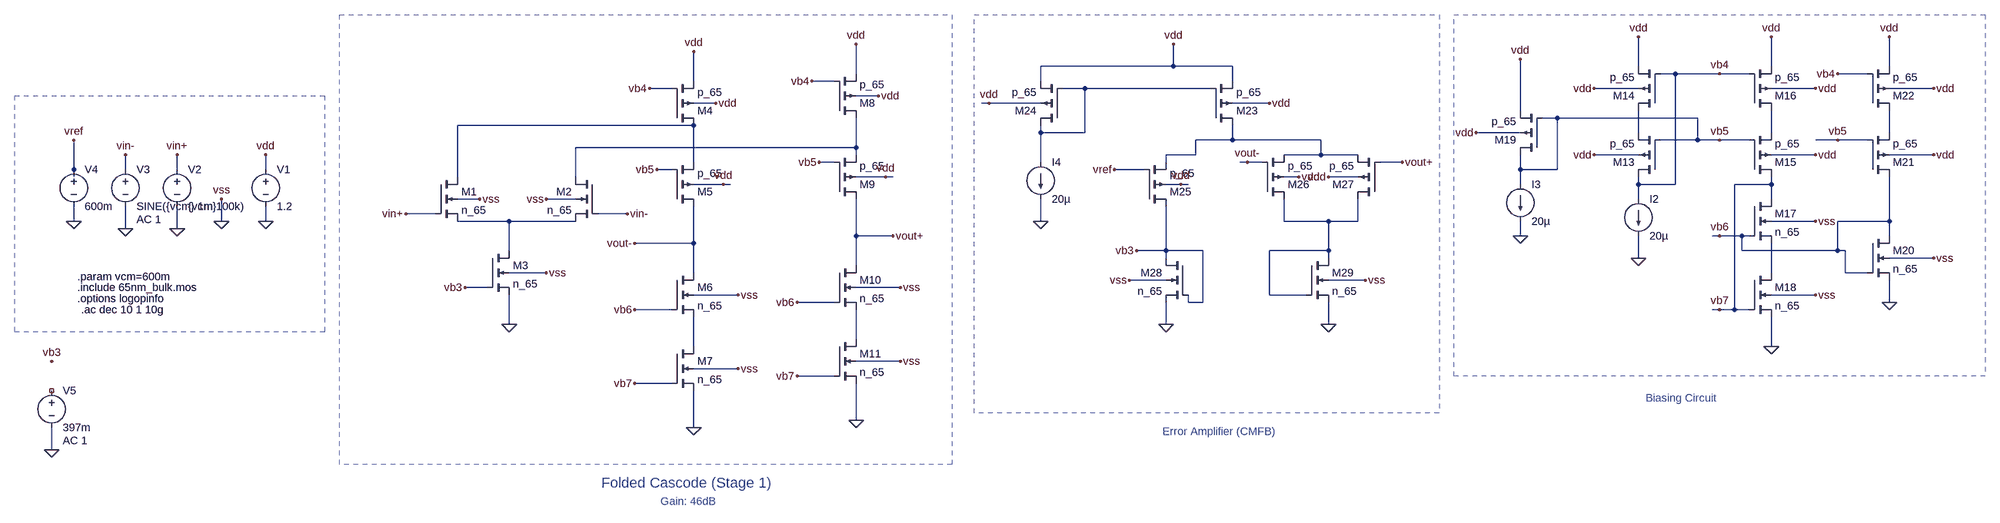
[diagram p0: schematic FC_DiffAmp_CMFB.asc]
FC_DiffAmp_CMFB.asc, the LTspice schematic file:
Version 4.1
SHEET 1 5060 800
WIRE 1712 -160 1712 -208
WIRE 1712 -160 1424 -160
WIRE 1840 -160 1712 -160
WIRE 2720 -160 2720 -224
WIRE 3008 -160 3008 -224
WIRE 3264 -160 3264 -224
WIRE 1024 -144 1024 -208
WIRE 2800 -144 2768 -144
WIRE 2896 -144 2800 -144
WIRE 2960 -144 2896 -144
WIRE 3216 -144 3152 -144
WIRE 672 -128 672 -192
WIRE 976 -128 928 -128
WIRE 1424 -128 1424 -160
WIRE 1840 -128 1840 -160
WIRE 624 -112 576 -112
WIRE 1520 -112 1472 -112
WIRE 1792 -112 1520 -112
WIRE 2720 -112 2624 -112
WIRE 3104 -112 3008 -112
WIRE 3360 -112 3264 -112
WIRE 1072 -96 1024 -96
WIRE 720 -80 672 -80
WIRE 1312 -80 1296 -80
WIRE 1424 -80 1312 -80
WIRE 1920 -80 1840 -80
WIRE 2464 -64 2464 -176
WIRE 2544 -48 2512 -48
WIRE 2848 -48 2544 -48
WIRE 672 -32 160 -32
WIRE 1424 -16 1424 -32
WIRE 1520 -16 1520 -112
WIRE 1520 -16 1424 -16
WIRE 2464 -16 2368 -16
WIRE 2720 -16 2720 -64
WIRE 3008 -16 3008 -64
WIRE 3264 -16 3264 -64
WIRE 1840 0 1840 -32
WIRE 1840 0 1760 0
WIRE 2032 0 1840 0
WIRE 2848 0 2848 -48
WIRE 2848 0 2768 0
WIRE 2896 0 2848 0
WIRE 2960 0 2896 0
WIRE 3152 0 3104 0
WIRE 3216 0 3152 0
WIRE 1024 16 1024 -48
WIRE 1024 16 416 16
WIRE 1024 32 1024 16
WIRE 1760 32 1760 0
WIRE 1760 32 1696 32
WIRE 2032 32 2032 0
WIRE 2032 32 1952 32
WIRE 2112 32 2032 32
WIRE 2720 32 2624 32
WIRE 3104 32 3008 32
WIRE 3360 32 3264 32
WIRE 672 48 672 -32
WIRE 976 48 944 48
WIRE 1424 48 1424 -16
WIRE 1696 48 1696 32
WIRE 1872 48 1856 48
WIRE 1904 48 1872 48
WIRE 2208 48 2160 48
WIRE -672 64 -672 0
WIRE -560 64 -560 32
WIRE -448 64 -448 32
WIRE -256 64 -256 32
WIRE 624 64 592 64
WIRE 1648 64 1584 64
WIRE 2464 64 2464 32
WIRE 2544 64 2544 -48
WIRE 2544 64 2464 64
WIRE -672 80 -672 64
WIRE 160 80 160 -32
WIRE 416 80 416 16
WIRE 1088 80 1024 80
WIRE 1104 80 1088 80
WIRE 1984 80 1952 80
WIRE 2112 80 2048 80
WIRE 736 96 672 96
WIRE 752 96 736 96
WIRE 1728 96 1696 96
WIRE 1744 96 1728 96
WIRE 2464 96 2464 64
WIRE 2720 96 2720 80
WIRE 2800 96 2800 -144
WIRE 2800 96 2720 96
WIRE 3008 96 3008 80
WIRE 3008 96 2928 96
WIRE 208 128 160 128
WIRE 416 128 352 128
WIRE 2720 128 2720 96
WIRE 3008 128 3008 96
WIRE 112 160 48 160
WIRE 528 160 464 160
WIRE -672 176 -672 144
WIRE -352 176 -352 128
WIRE -256 176 -256 144
WIRE 272 176 160 176
WIRE 416 176 272 176
WIRE 1424 176 1424 128
WIRE 1952 176 1952 128
WIRE 2048 176 1952 176
WIRE 2112 176 2112 128
WIRE 2112 176 2048 176
WIRE 3104 176 3008 176
WIRE 3264 176 3264 80
WIRE 3264 176 3152 176
WIRE -560 192 -560 144
WIRE -448 192 -448 144
WIRE 1024 208 1024 128
WIRE 1104 208 1024 208
WIRE 2464 208 2464 176
WIRE 2896 208 2880 208
WIRE 2944 208 2896 208
WIRE 2960 208 2944 208
WIRE 3264 208 3264 176
WIRE 672 224 672 144
WIRE 672 224 544 224
WIRE 272 240 272 176
WIRE 1696 240 1696 144
WIRE 1696 240 1632 240
WIRE 1776 240 1696 240
WIRE 2048 240 2048 176
WIRE 2048 240 1920 240
WIRE 2944 240 2944 208
WIRE 3152 240 3152 176
WIRE 3152 240 2944 240
WIRE 3168 240 3152 240
WIRE 1696 256 1696 240
WIRE 2048 256 2048 240
WIRE 2720 256 2720 208
WIRE 3360 256 3264 256
WIRE 1024 272 1024 208
WIRE 352 288 272 288
WIRE 672 288 672 224
WIRE 3008 288 3008 224
WIRE 3168 288 3168 240
WIRE 3216 288 3168 288
WIRE 1696 304 1616 304
WIRE 2128 304 2048 304
WIRE 224 320 176 320
WIRE 1120 320 1024 320
WIRE 768 336 672 336
WIRE 1920 336 1920 240
WIRE 2000 336 1920 336
WIRE 3104 336 3008 336
WIRE 976 352 896 352
WIRE 1744 352 1744 336
WIRE 1776 352 1776 240
WIRE 1776 352 1744 352
WIRE 3264 352 3264 304
WIRE 624 368 544 368
WIRE 2896 368 2880 368
WIRE 2928 368 2928 96
WIRE 2928 368 2896 368
WIRE 2960 368 2928 368
WIRE 272 400 272 336
WIRE 1696 400 1696 352
WIRE 2048 400 2048 352
WIRE 1024 432 1024 368
WIRE 672 448 672 384
WIRE 3008 448 3008 384
WIRE 1120 480 1024 480
WIRE 768 496 672 496
WIRE 976 512 896 512
WIRE 624 528 544 528
WIRE 1024 608 1024 528
WIRE 672 624 672 544
WIRE -720 672 -720 624
FLAG 208 128 vss
FLAG 352 128 vss
FLAG -352 176 0
FLAG -256 176 0
FLAG -256 32 vdd
FLAG -352 128 vss
FLAG 48 160 vin+
FLAG 352 288 vss
FLAG 272 400 0
FLAG 176 320 vb3
FLAG 720 -80 vdd
FLAG 736 96 vdd
FLAG 672 -192 vdd
FLAG 592 64 vb5
FLAG 576 -112 vb4
FLAG 544 368 vb6
FLAG 544 528 vb7
FLAG 768 496 vss
FLAG 768 336 vss
FLAG 672 624 0
FLAG 1072 -96 vdd
FLAG 1088 80 vdd
FLAG 1024 -208 vdd
FLAG 944 48 vb5
FLAG 928 -128 vb4
FLAG 896 352 vb6
FLAG 896 512 vb7
FLAG 1120 480 vss
FLAG 1120 320 vss
FLAG 1024 608 0
FLAG 1104 208 vout+
FLAG 544 224 vout-
FLAG -448 192 0
FLAG -560 192 0
FLAG -448 32 vin+
FLAG -560 32 vin-
FLAG 2720 256 0
FLAG 2624 -112 vdd
FLAG 2624 32 vdd
FLAG 2720 -224 vdd
FLAG 3104 -112 vdd
FLAG 3104 32 vdd
FLAG 3008 -224 vdd
FLAG 2896 0 vb5
FLAG 2896 -144 vb4
FLAG 3008 448 0
FLAG 3104 336 vss
FLAG 3104 176 vss
FLAG 2896 368 vb7
FLAG 2896 208 vb6
FLAG 2464 -176 vdd
FLAG 2368 -16 vdd
FLAG 2464 208 0
FLAG 3360 256 vss
FLAG 3264 352 0
FLAG 3360 -112 vdd
FLAG 3360 32 vdd
FLAG 3264 -224 vdd
FLAG 3152 0 vb5
FLAG 3152 -144 vb4
FLAG 528 160 vin-
FLAG -672 0 vref
FLAG -672 176 0
FLAG 1312 -80 vdd
FLAG 1920 -80 vdd
FLAG 1712 -208 vdd
FLAG 1424 176 0
FLAG 1616 304 vss
FLAG 1728 96 vdd
FLAG 1984 80 vdd
FLAG 2048 80 vdd
FLAG 2208 48 vout+
FLAG 1872 48 vout-
FLAG 2048 400 0
FLAG 1696 400 0
FLAG 1584 64 vref
FLAG 2128 304 vss
FLAG -720 480 vb3
FLAG -720 672 0
FLAG 1632 240 vb3
SYMBOL nmos4 112 80 R0
SYMATTR InstName M1
SYMATTR Value n_65
SYMATTR Value2 l=200n w=80u
SYMBOL nmos4 464 80 M0
SYMATTR InstName M2
SYMATTR Value n_65
SYMATTR Value2 l=200n w=80u
SYMBOL voltage -256 48 R0
WINDOW 123 0 0 Left 0
WINDOW 39 0 0 Left 0
SYMATTR InstName V1
SYMATTR Value 1.2
SYMBOL nmos4 224 240 R0
SYMATTR InstName M3
SYMATTR Value n_65
SYMATTR Value2 l=200n w=5u
SYMBOL pmos4 624 -32 M180
SYMATTR InstName M4
SYMATTR Value p_65
SYMATTR Value2 l=200n w=10u
SYMBOL pmos4 624 144 M180
SYMATTR InstName M5
SYMATTR Value p_65
SYMATTR Value2 l=200n w=10u
SYMBOL nmos4 624 288 R0
SYMATTR InstName M6
SYMATTR Value n_65
SYMATTR Value2 l=200n w=10u
SYMBOL nmos4 624 448 R0
SYMATTR InstName M7
SYMATTR Value n_65
SYMATTR Value2 l=200n w=10u
SYMBOL pmos4 976 -48 M180
SYMATTR InstName M8
SYMATTR Value p_65
SYMATTR Value2 l=200n w=10u
SYMBOL pmos4 976 128 M180
SYMATTR InstName M9
SYMATTR Value p_65
SYMATTR Value2 l=200n w=10u
SYMBOL nmos4 976 272 R0
SYMATTR InstName M10
SYMATTR Value n_65
SYMATTR Value2 l=200n w=10u
SYMBOL nmos4 976 432 R0
SYMATTR InstName M11
SYMATTR Value n_65
SYMATTR Value2 l=200n w=10u
SYMBOL voltage -448 48 R0
WINDOW 123 0 0 Left 0
WINDOW 39 0 0 Left 0
SYMATTR InstName V2
SYMATTR Value {vcm}
SYMBOL voltage -560 48 R0
WINDOW 123 24 124 Left 2
WINDOW 39 0 0 Left 0
SYMATTR Value2 AC 1
SYMATTR InstName V3
SYMATTR Value SINE({vcm} 1m 100k)
SYMBOL current 2720 128 R0
WINDOW 123 0 0 Left 0
WINDOW 39 0 0 Left 0
SYMATTR InstName I2
SYMATTR Value 20µ
SYMBOL pmos4 2768 80 R180
SYMATTR InstName M13
SYMATTR Value p_65
SYMATTR Value2 l=200n w=20u
SYMBOL pmos4 2768 -64 R180
SYMATTR InstName M14
SYMATTR Value p_65
SYMATTR Value2 l=200n w=10u
SYMBOL pmos4 2960 80 M180
SYMATTR InstName M15
SYMATTR Value p_65
SYMATTR Value2 l=200n w=20u
SYMBOL pmos4 2960 -64 M180
SYMATTR InstName M16
SYMATTR Value p_65
SYMATTR Value2 l=200n w=10u
SYMBOL nmos4 2960 128 R0
SYMATTR InstName M17
SYMATTR Value n_65
SYMATTR Value2 l=200n w=20u
SYMBOL nmos4 2960 288 R0
SYMATTR InstName M18
SYMATTR Value n_65
SYMATTR Value2 l=200n w=20u
SYMBOL pmos4 2512 32 R180
SYMATTR InstName M19
SYMATTR Value p_65
SYMATTR Value2 l=200n w=5u
SYMBOL current 2464 96 R0
WINDOW 123 0 0 Left 0
WINDOW 39 0 0 Left 0
SYMATTR InstName I3
SYMATTR Value 20µ
SYMBOL nmos4 3216 208 R0
SYMATTR InstName M20
SYMATTR Value n_65
SYMATTR Value2 l=200n w=5u
SYMBOL pmos4 3216 80 M180
SYMATTR InstName M21
SYMATTR Value p_65
SYMATTR Value2 l=200n w=20u
SYMBOL pmos4 3216 -64 M180
SYMATTR InstName M22
SYMATTR Value p_65
SYMATTR Value2 l=200n w=10u
SYMBOL voltage -672 48 R0
WINDOW 123 0 0 Left 0
WINDOW 39 0 0 Left 0
SYMATTR InstName V4
SYMATTR Value 600m
SYMBOL pmos4 1792 -32 M180
SYMATTR InstName M23
SYMATTR Value p_65
SYMATTR Value2 l=300n w=40u
SYMBOL pmos4 1472 -32 R180
SYMATTR InstName M24
SYMATTR Value p_65
SYMATTR Value2 l=300n w=10u
SYMBOL current 1424 48 R0
WINDOW 123 0 0 Left 0
WINDOW 39 0 0 Left 0
SYMATTR InstName I4
SYMATTR Value 20µ
SYMBOL pmos4 1648 144 M180
SYMATTR InstName M25
SYMATTR Value p_65
SYMATTR Value2 l=300n w=10u
SYMBOL pmos4 1904 128 M180
SYMATTR InstName M26
SYMATTR Value p_65
SYMATTR Value2 l=300n w=10u
SYMBOL pmos4 2160 128 R180
SYMATTR InstName M27
SYMATTR Value p_65
SYMATTR Value2 l=300n w=10u
SYMBOL nmos4 1744 256 M0
SYMATTR InstName M28
SYMATTR Value n_65
SYMATTR Value2 l=200n w=5u
SYMBOL nmos4 2000 256 R0
SYMATTR InstName M29
SYMATTR Value n_65
SYMATTR Value2 l=200n w=5u
SYMBOL voltage -720 528 R0
WINDOW 123 24 124 Left 2
WINDOW 39 0 0 Left 0
SYMATTR InstName V5
SYMATTR Value 397m
SYMATTR Value2 AC 1
TEXT 472 744 Left 3 ;Folded Cascode (Stage 1)
TEXT -664 320 Left 2 !.include 65nm_bulk.mos
TEXT 2736 560 Left 2 ;Biasing Circuit
TEXT -664 296 Left 2 !.param vcm=600m
TEXT -664 344 Left 2 !.options logopinfo
TEXT 600 784 Left 2 ;Gain: 46dB
TEXT 1688 632 Left 2 ;Error Amplifier (CMFB)
TEXT -656 368 Left 2 !.ac dec 10 1 10g
RECTANGLE Normal 1232 704 -96 -272 2
RECTANGLE Normal -128 416 -800 -96 2
RECTANGLE Normal 2288 592 1280 -272 2
RECTANGLE Normal 3472 512 2320 -272 2

The netlist it stands for:
* FC_DiffAmp_CMFB.asc
M1 N002 vin+ N008 0 n_65 l=200n w=80u
M2 N007 vin- N008 0 n_65 l=200n w=80u
V1 vdd 0 1.2
M3 N008 vb3 0 0 n_65 l=200n w=5u
M4 N002 vb4 vdd vdd p_65 l=200n w=10u
M5 vout- vb5 N002 vdd p_65 l=200n w=10u
M6 vout- vb6 N012 0 n_65 l=200n w=10u
M7 N012 vb7 0 0 n_65 l=200n w=10u
M8 N007 vb4 vdd vdd p_65 l=200n w=10u
M9 vout+ vb5 N007 vdd p_65 l=200n w=10u
M10 vout+ vb6 N011 0 n_65 l=200n w=10u
M11 N011 vb7 0 0 n_65 l=200n w=10u
V2 vin+ 0 {vcm}
V3 vin- 0 SINE({vcm} 1m 100k) AC 1
I2 vb4 0 20µ
M13 vb4 vb5 N003 vdd p_65 l=200n w=20u
M14 N003 vb4 vdd vdd p_65 l=200n w=10u
M15 vb7 vb5 N004 vdd p_65 l=200n w=20u
M16 N004 vb4 vdd vdd p_65 l=200n w=10u
M17 vb7 vb6 N010 0 n_65 l=200n w=20u
M18 N010 vb7 0 0 n_65 l=200n w=20u
M19 vb5 vb5 vdd vdd p_65 l=200n w=5u
I3 vb5 0 20µ
M20 vb6 vb6 0 0 n_65 l=200n w=5u
M21 vb6 vb5 N005 vdd p_65 l=200n w=20u
M22 N005 vb4 vdd vdd p_65 l=200n w=10u
V4 vref 0 600m
M23 N006 N001 vdd vdd p_65 l=300n w=40u
M24 N001 N001 vdd vdd p_65 l=300n w=10u
I4 N001 0 20µ
M25 vb3 vref N006 vdd p_65 l=300n w=10u
M26 N009 vout- N006 vdd p_65 l=300n w=10u
M27 N009 vout+ N006 vdd p_65 l=300n w=10u
M28 vb3 vb3 0 0 n_65 l=200n w=5u
M29 N009 N009 0 0 n_65 l=200n w=5u
V5 NC_01 0 397m AC 1
.model NMOS NMOS
.model PMOS PMOS
.lib standard.mos
* Folded Cascode (Stage 1)
.include 65nm_bulk.mos
* Biasing Circuit
.param vcm=600m
.options logopinfo
* Gain: 46dB
* Error Amplifier (CMFB)
.ac dec 10 1 10g
.backanno
.end